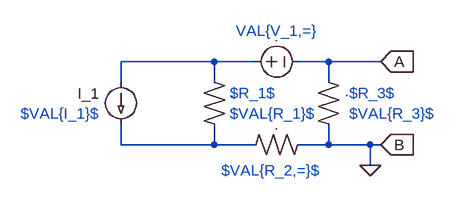
[diagram p0: schematic test01.asc]
test01.asc, the LTspice schematic file:
Version 4
SHEET 1 1120 680
WIRE -832 128 -976 128
WIRE -768 128 -832 128
WIRE -656 128 -704 128
WIRE -576 128 -656 128
WIRE -976 160 -976 128
WIRE -832 160 -832 128
WIRE -656 160 -656 128
WIRE -976 256 -976 224
WIRE -832 256 -832 224
WIRE -832 256 -976 256
WIRE -768 256 -832 256
WIRE -656 256 -656 224
WIRE -656 256 -704 256
WIRE -592 256 -656 256
WIRE -576 256 -592 256
WIRE -592 288 -592 256
FLAG -592 288 0
FLAG -576 128 A
IOPIN -576 128 In
FLAG -576 256 B
IOPIN -576 256 In
SYMBOL svg\\svg_voltage -768 128 R270
WINDOW 0 24 32 VTop 2
WINDOW 3 33 33 VTop 2
SYMATTR InstName .
SYMATTR Value ""
SYMBOL svg\\svg_current -976 160 R0
WINDOW 0 -33 17 Right 2
WINDOW 3 -33 53 Right 2
SYMATTR InstName I_1
SYMATTR Value ""
SYMBOL svg\\svg_res -848 160 R0
WINDOW 0 40 15 Left 2
WINDOW 3 39 50 Left 2
SYMATTR InstName .
SYMATTR Value ""
SYMBOL svg\\svg_res -672 160 R0
WINDOW 0 41 13 Left 2
WINDOW 3 41 50 Left 2
SYMATTR InstName .
SYMATTR Value ""
SYMBOL svg\\svg_res -704 240 R90
WINDOW 0 0 32 VBottom 2
WINDOW 3 32 32 VTop 2
SYMATTR InstName .
SYMATTR Value ""
TEXT -1008 208 Right 2 ;$VAL{I_1}$
TEXT -736 96 Bottom 2 ;VAL{V_1,=}
TEXT -808 176 Left 2 ;$R_1$
TEXT -808 208 Left 2 ;$VAL{R_1}$
TEXT -744 280 Top 2 ;$VAL{R_2,=}$
TEXT -624 176 Left 2 ;$R_3$
TEXT -624 208 Left 2 ;$VAL{R_3}$

The netlist it stands for:
* test01.asc
V§. N001 A
I_1 N001 N002
R§. N001 N002
R§. A 0
R§. 0 N002
* $VAL{I_1}$
* VAL{V_1,=}
* $R_1$
* $VAL{R_1}$
* $VAL{R_2,=}$
* $R_3$
* $VAL{R_3}$
.backanno
.end